# Altium schematic sheet FPGA_B35.SchDoc: TE0722
size A4; Organization: Trenz Electronic GmbH; DocumentNumber: 3; Revision: 01; SheetNumber: 3; SheetTotal: 8; Date: 07.11.2014; PageSetup: Record=PageOptions|CenterHorizontal=True|CenterVertical=True|PrintScale=0.96|XCorrection=1.00|YCorrection=1.00|PrintKind=0|BorderSize=5000000|LeftOffset=0|BottomOffset=0|Orientation=2|PaperLength=1000|PaperWidth=1000|Scale=100|PaperSource=7|PrintQuality=-4|MediaType=1|DitherType=10|PaperKind=A4|PrintScaleMode=1
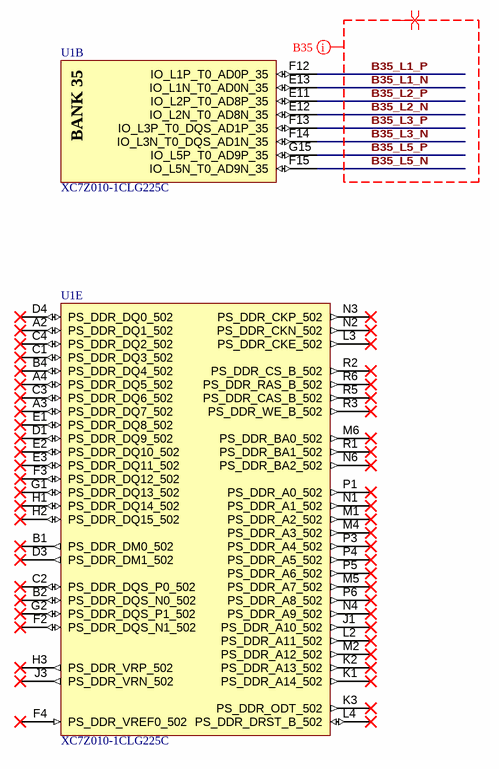
[diagram p0: FPGA_B35.SchDoc]

## Parts
U1  XC7Z010-1CLG225C  [CLG225]  (parts B,E of 8)

## Nets
B35_L1_N: U1.E13(IO_L1N_T0_AD0N_35)
B35_L1_P: U1.F12(IO_L1P_T0_AD0P_35)
B35_L2_N: U1.E12(IO_L2N_T0_AD8N_35)
B35_L2_P: U1.E11(IO_L2P_T0_AD8P_35)
B35_L3_N: U1.F14(IO_L3N_T0_DQS_AD1N_35)
B35_L3_P: U1.F13(IO_L3P_T0_DQS_AD1P_35)
B35_L5_N: U1.F15(IO_L5N_T0_AD9N_35)
B35_L5_P: U1.G15(IO_L5P_T0_AD9P_35)

Not connected (* = marked no-connect by the designer): U1 A2(PS_DDR_DQ1_502)* A3(PS_DDR_DQ7_502)* A4(PS_DDR_DQ5_502)* B1(PS_DDR_DM0_502)* B2(PS_DDR_DQS_N0_502)* B4(PS_DDR_DQ4_502)* C1(PS_DDR_DQ3_502)* C2(PS_DDR_DQS_P0_502)* C3(PS_DDR_DQ6_502)* C4(PS_DDR_DQ2_502)* D1(PS_DDR_DQ9_502)* D3(PS_DDR_DM1_502)* D4(PS_DDR_DQ0_502)* E1(PS_DDR_DQ8_502)* E2(PS_DDR_DQ10_502)* E3(PS_DDR_DQ11_502)* F2(PS_DDR_DQS_N1_502)* F3(PS_DDR_DQ12_502)* F4(PS_DDR_VREF0_502)* G1(PS_DDR_DQ13_502)* G2(PS_DDR_DQS_P1_502)* H1(PS_DDR_DQ14_502)* H2(PS_DDR_DQ15_502)* H3(PS_DDR_VRP_502)* J1(PS_DDR_A10_502)* J3(PS_DDR_VRN_502)* K1(PS_DDR_A14_502)* K2(PS_DDR_A13_502)* K3(PS_DDR_ODT_502)* L2(PS_DDR_A11_502)* L3(PS_DDR_CKE_502)* L4(PS_DDR_DRST_B_502)* M1(PS_DDR_A2_502)* M2(PS_DDR_A12_502)* M4(PS_DDR_A3_502)* M5(PS_DDR_A7_502)* M6(PS_DDR_BA0_502)* N1(PS_DDR_A1_502)* N2(PS_DDR_CKN_502)* N3(PS_DDR_CKP_502)* N4(PS_DDR_A9_502)* N6(PS_DDR_BA2_502)* P1(PS_DDR_A0_502)* P3(PS_DDR_A4_502)* P4(PS_DDR_A5_502)* P5(PS_DDR_A6_502)* P6(PS_DDR_A8_502)* R1(PS_DDR_BA1_502)* R2(PS_DDR_CS_B_502)* R3(PS_DDR_WE_B_502)* R5(PS_DDR_CAS_B_502)* R6(PS_DDR_RAS_B_502)*

## Layout directives
net class B35: B35_L1_N, B35_L1_P, B35_L2_N, B35_L2_P, B35_L3_N, B35_L3_P, B35_L5_N, B35_L5_P
differential pair: B35_L1_N, B35_L1_P, B35_L2_N, B35_L2_P, B35_L3_N, B35_L3_P, B35_L5_N, B35_L5_P

## Notes on the sheet
- Title:
- Nummer:
- Rev.
- Datum:
- A4
- Zeichner:
- Blatt
- von
- Filename:
- (in symbol 26308, part B) BANK 35

## Library data of the parts
U1 = 26308: AN: 26308; Mixed: SMT; Case: CLG225; HelpURL: B:\AD\adlib\datasheet\XC7\Zynq